# Altium schematic sheet BF24_1.SchDoc
size 300 x 200 mm
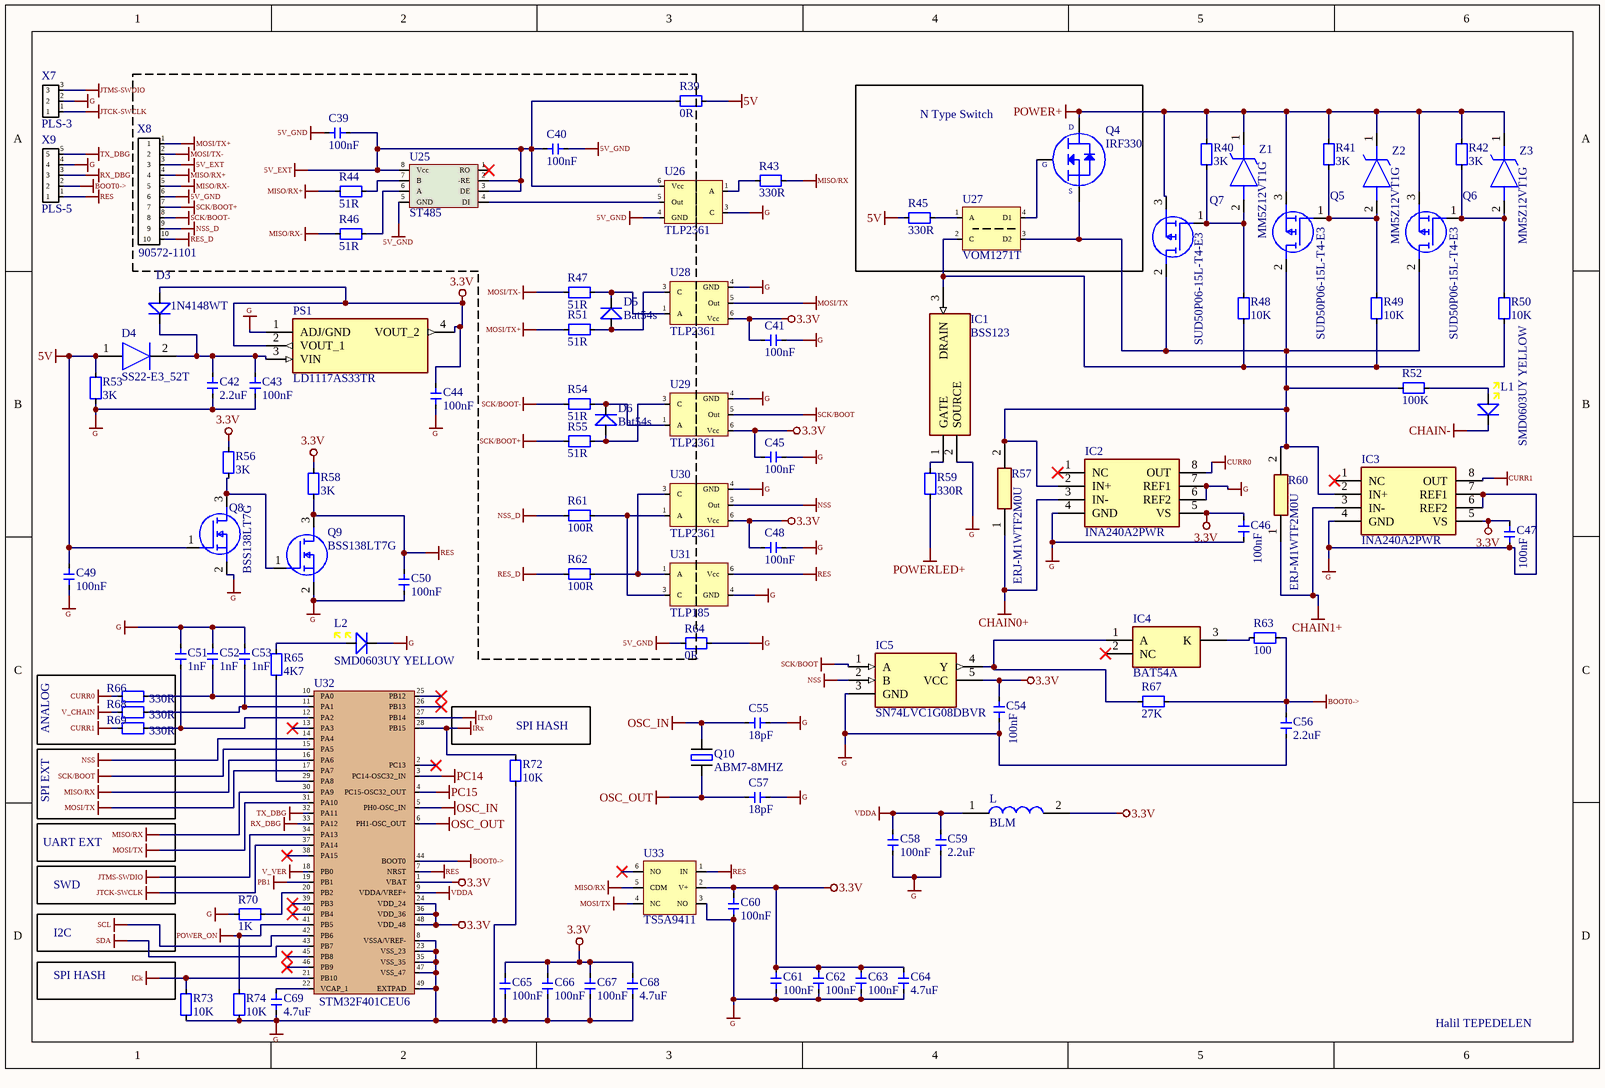
[diagram p0: BF24_1.SchDoc]

## Parts
C39  100nF  [C-0402R]
C40  100nF  [C-0402R]
C41  100nF  [C-0402R]
C42  2.2uF  [C-0402R]
C43  100nF  [C-0402R]
C44  100nF  [C-0402R]
C45  100nF  [C-0402R]
C46  100nF  [C-0402R]
C47  100nF  [C-0402R]
C48  100nF  [C-0402R]
C49  100nF  [C-0402R]
C50  100nF  [C-0402R]
C51  1nF  [C-0603W]
C52  1nF  [C-0603W]
C53  1nF  [C-0603W]
C54  100nF  [C-0402R]
C55  18pF  [C-0402R]
C56  2.2uF  [C-0603W]
C57  18pF  [C-0402R]
C58  100nF  [C-0402R]
C59  2.2uF  [C-0402R]
C60  100nF  [C-0402R]
C61  100nF  [C-0402R]
C62  100nF  [C-0402R]
C63  100nF  [C-0402R]
C64  4.7uF  [C-0603W]
C65  100nF  [C-0402R]
C66  100nF  [C-0402R]
C67  100nF  [C-0402R]
C68  4.7uF  [C-0603W]
C69  4.7uF  [C-0603W]
D3  1N4148WT  [1n4148]
D4  SS22-E3_52T  [ss22]
D5  Bat54s  [bat54s]
D6  Bat54s  [bat54s]
IC1  BSS123  [bss123]
IC2  INA240A2PWR  [ina240]
IC3  INA240A2PWR  [ina240]
IC4  BAT54A  [bat54a]
IC5  SN74LVC1G08DBVR  [sn74lvc]
L  BLM  [R-0603W]
L1  SMD0603UY YELLOW  [R-0603W]
L2  SMD0603UY YELLOW  [R-0603W]
PS1  LD1117AS33TR  [ld1117a]
Q4  IRF330  [DPAK_TO263]
Q5  SUD50P06-15L-T4-E3  [SUD50P0615LT4E3]
Q6  SUD50P06-15L-T4-E3  [SUD50P0615LT4E3]
Q7  SUD50P06-15L-T4-E3  [SUD50P0615LT4E3]
Q8  BSS138LT7G  [bss138]
Q9  BSS138LT7G  [bss138]
Q10  ABM7-8MHZ  [abm-8mhz]
R39  0R  [R-0402R]
R40  3K  [R-0402R]
R41  3K  [R-0402R]
R42  3K  [R-0402R]
R43  330R  [R-0402R]
R44  51R  [R-0603W]
R45  330R  [R-0603W]
R46  51R  [R-0603W]
R47  51R  [R-0603W]
R48  10K  [R-1206W]
R49  10K  [R-1206W]
R50  10K  [R-1206W]
R51  51R  [R-0603W]
R52  100K  [R-0603W]
R53  3K  [R-0402R]
R54  51R  [R-0603W]
R55  51R  [R-0603W]
R56  3K  [R-0402R]
R57  ERJ-M1WTF2M0U  [R-1210R]
R58  3K  [R-0402R]
R59  330R  [R-0603W]
R60  ERJ-M1WTF2M0U  [R-1210R]
R61  100R  [R-0603W]
R62  100R  [R-0603W]
R63  100  [R-0603W]
R64  0R  [R-0402R]
R65  4K7  [R-0603W]
R66  330R  [R-0603W]
R67  27K  [R-0402R]
R68  330R  [R-0603W]
R69  330R  [R-0603W]
R70  1K  [R-0402R]
R72  10K  [R-0402R]
R73  10K  [R-0402R]
R74  10K  [R-0402R]
U25  ST485  [st485]
U26  TLP2361  [tlp2361]
U27  VOM1271T  [vom12]
U28  TLP2361  [tlp2361]
U29  TLP2361  [tlp2361]
U30  TLP2361  [tlp2361]
U31  TLP185  [tlp185]
U32  STM32F401CEU6  [stm32f401ceu6]
U33  TS5A9411  [ts5a9411]
X7  PLS-3  [3pinCon]
X8  90572-1101  [idc20]
X9  PLS-5  [5pinCon]
Z1  MM5Z12VT1G  [mm5z]
Z2  MM5Z12VT1G  [mm5z]
Z3  MM5Z12VT1G  [mm5z]

## Blocks framed on the sheet
N Type Switch: Q4 R45 U27
ANALOG: R66 R68 R69

## Nets
3.3V: C41.1 C44.2 C45.1 C46.2 C47.2 C48.1 C54.2 C60.2 C61.2 C62.2 C63.2 C64.2 C65.2 C66.2 C67.2 C68.2 D3.2 IC2.5(VS) IC3.5(VS) IC5.5(VCC) L.2 PS1.2(VOUT_1) PS1.4(VOUT_2) R56.2 R58.2 U28.6(Vcc) U29.6(Vcc) U30.6(Vcc) U32.1(VBAT) U32.24(VDD_24) U32.36(VDD_36) U32.48(VDD_48) U33.2(V+)
5V: C49.2 D4.1(A) Q8.1(G) R39.2 R45.1 R53.2
5V_EXT: C39.2 C40.1 R39.1 U25.2(-RE) U25.3(DE) U25.8(Vcc) U26.6(Vcc) X8.3
5V_GND: C39.1 C40.2 R64.1 U25.5(GND) U26.4(GND) X8.6
BOOT0->: C56.2 R63.2 R67.2 U32.44(BOOT0) X9.2
CHAIN0+: IC2.3(IN-) R57.1
CHAIN1+: IC3.3(IN-) R60.1
CHAIN-: L1.2
CURR0: IC2.8(OUT) R66.1
CURR1: IC3.8(OUT) R69.1
G: C41.2 C42.1 C43.1 C44.1 C45.2 C46.1 C47.1 C48.2 C49.1 C50.1 C51.2 C52.2 C53.2 C54.1 C55.2 C56.1 C57.2 C58.1 C59.1 C60.1 C61.1 C62.1 C63.1 C64.1 C65.1 C66.1 C67.1 C68.1 C69.1 IC1.2(SOURCE) IC2.4(GND) IC2.6(REF2) IC2.7(REF1) IC3.4(GND) IC3.6(REF2) IC3.7(REF1) IC5.3(GND) L2.2 PS1.1(ADJ/GND) Q8.2(S) Q9.2(S) R53.1 R64.2 R70.1 R72.1 R73.1 R74.1 U26.3(C) U28.4(GND) U29.4(GND) U30.4(GND) U31.4(GND) U32.8(VSSA/VREF-) U32.23(VSS_23) U32.35(VSS_35) U32.47(VSS_47) U32.49(EXTPAD) U33.3(NO) X7.2 X9.4
ICk: R73.2 U32.21(PB10)
IRx: R72.2 U32.28(PB15)
ITx0: U32.27(PB14)
JTCK-SWCLK: U32.37(PA14) X7.1
JTMS-SWDIO: U32.34(PA13) X7.3
MISO/RX: R43.2 U32.16(PA6) U32.30(PA9) U33.5(CDM)
MISO/RX+: R44.1 X8.4
MISO/RX-: R46.1 X8.5
MOSI/TX: U28.5(Out) U32.17(PA7) U32.31(PA10) U33.4(NC)
MOSI/TX+: R51.1 X8.1
MOSI/TX-: R47.1 X8.2
NSS: IC5.2(B) U30.5(Out) U32.14(PA4)
NSS_D: R61.1 X8.9
OSC_IN: C55.1 Q10.1 U32.5(PH0-OSC_IN)
OSC_OUT: C57.1 Q10.2 U32.6(PH1-OSC_OUT)
PB1: U32.19(PB1)
PC14: U32.3(PC14-OSC32_IN)
PC15: U32.4(PC15-OSC32_OUT)
POWER+: Q4.3 Q5.3(S) Q6.3(S) Q7.3(S) R40.2 R41.2 R42.2 Z1.1(K) Z2.1(K) Z3.1(K)
POWER_ON: R74.2 U32.41(PB5)
POWERLED+: R59.1
RES: C50.2 Q9.3(D) R58.1 U31.6(Vcc) U32.7(NRST) U33.1(IN) X9.1
RES_D: R62.1 X8.10
RX_DBG: U32.33(PA12) X9.3
SCK/BOOT: IC5.1(A) U29.5(Out) U32.15(PA5)
SCK/BOOT+: R55.1 X8.7
SCK/BOOT-: R54.1 X8.8
SCL: U32.42(PB6)
SDA: U32.43(PB7)
TX_DBG: U32.32(PA11) X9.5
V_CHAIN: R68.1
V_VER: U32.18(PB0)
VDDA: C58.2 C59.2 L.1 U32.9(VDDA/VREF+)
NetC42_2: C42.2 C43.2 D3.1 D4.2(K) PS1.3(VIN)
NetC51_1: C51.1 R69.2 U32.12(PA2)
NetC52_1: C52.1 R66.2 U32.10(PA0)
NetC53_1: C53.1 R68.2 U32.11(PA1)
NetC69_2: C69.2 U32.22(VCAP_1)
NetD5_1: D5.1 R51.2 U28.3(C)
NetD5_2: D5.2 R47.2 U28.1(A)
NetD6_1: D6.1 R55.2 U29.3(C)
NetD6_2: D6.2 R54.2 U29.1(A)
NetIC1_1: IC1.1(GATE) R59.2
NetIC1_3: IC1.3(DRAIN) R48.1 R49.1 R50.1 U27.2(C)
NetIC2_2: IC2.2(IN+) IC3.2(IN+) Q4.2 Q5.2(D) Q6.2(D) Q7.2(D) R52.1 R57.2 R60.2 U27.3(D2)
NetIC4_1: IC4.1(A) IC5.4(Y) R67.1
NetIC4_3: IC4.3(K) R63.1
NetL1_1: L1.1 R52.2
NetL2_1: L2.1 R65.2
NetQ4_1: Q4.1 U27.4(D1)
NetQ5_1: Q5.1(G) R41.1 R49.2 Z2.2(A)
NetQ6_1: Q6.1(G) R42.1 R50.2 Z3.2(A)
NetQ7_1: Q7.1(G) R40.1 R48.2 Z1.2(A)
NetQ8_3: Q8.3(D) Q9.1(G) R56.1
NetR43_1: R43.1 U26.1(A)
NetR44_2: R44.2 U25.7(B)
NetR45_2: R45.2 U27.1(A)
NetR46_2: R46.2 U25.6(A)
NetR61_2: R61.2 U30.1(A) U31.3(C)
NetR62_2: R62.2 U30.3(C) U31.1(A)
NetR65_1: R65.1 U32.29(PA8)
NetR70_2: R70.2 U32.20(PB2)
NetU25_4: U25.4(DI) U26.5(Out)

Not connected (* = marked no-connect by the designer): IC2 1(NC)*; IC3 1(NC)*; IC4 2(NC)*; U25 1(RO)*; U32 2(PC13)* 13(PA3)* 25(PB12)* 26(PB13)* 38(PA15)* 39(PB3)* 40(PB4)* 45(PB8)* 46(PB9)*; U33 6(NO)*

## Notes on the sheet
- (near R72) SPI HASH
- SPI EXT
- UART EXT
- SWD
- I2C
- SPI HASH
- Halil TEPEDELEN
- (in symbol IRF3330) D; G; S

## Library data of the parts
C39-C41 C43-C50 C54 C58 C60-C63 C65-C67 = 100nF 0402
C42 C59 = 2.2uF 0402
C51-C53 = 1nF 0603
C55 C57 = 18pF 0402
C56 = 2.2uF 0603
C64 C68 C69 = 4.7uF 0603
D4 = SS22-E3_52T: Diode; Manufacturer_Name: Vishay; Manufacturer_Part_Number: SS22-E3/52T; Datasheet Link: https://componentsearchengine.com/Datasheets/2/SS22-E3_52T.pdf; Height: 2.44mm; Arrow Part Number: SS22-E3/52T; Arrow Price/Stock: https://www.arrow.com/en/products/ss22-e352t/vishay; Mouser Part Number: 625-SS22-E3; Mouser Price/Stock: https://www.mouser.com/Search/Refine.aspx?Keyword=625-SS22-E3
IC1 = BSS123: Integrated Circuit; Manufacturer_Name: Nexperia; Datasheet Link: http://docs-emea.rs-online.com/webdocs/1270/0900766b81270fbb.pdf; Height: 1.1mm; Manufacturer_Part_Number: BSS123; Mouser Part Number: N/A; Mouser Price/Stock: https://www.mouser.com/Search/Refine.aspx?Keyword=N%2FA
IC2 IC3 = INA240A2PWR: Integrated Circuit; Manufacturer_Name: Texas Instruments; Datasheet Link: http://www.ti.com/lit/gpn/INA240; Height: 1.2mm; Manufacturer_Part_Number: INA240A2PWR; Arrow Part Number: INA240A2PWR; Arrow Price/Stock: https://www.arrow.com/en/products/ina240a2pwr/texas-instruments; Mouser Part Number: 595-INA240A2PWR; Mouser Price/Stock: https://www.mouser.co.uk/ProductDetail/Texas-Instruments/INA240A2PWR?qs=aVyJF2WnouQyoKZt%2F7Ylhw%3D%3D
IC4 = BAT54A: Integrated Circuit; Manufacturer_Name: STMicroelectronics; Datasheet Link: http://www.st.com/web/en/resource/technical/document/datasheet/CD00001322.pdf; Height: 1.5mm; Manufacturer_Part_Number: BAT54A
IC5 = SN74LVC1G08DBVR: Integrated Circuit; Manufacturer_Name: Texas Instruments; Datasheet Link: http://www.ti.com/lit/ds/symlink/sn74lvc1g08.pdf; Height: 1.45mm; Manufacturer_Part_Number: SN74LVC1G08DBVR; Arrow Part Number: SN74LVC1G08DBVR; Arrow Price/Stock: https://www.arrow.com/en/products/sn74lvc1g08dbvr/texas-instruments; Mouser Part Number: 595-SN74LVC1G08DBVR; Mouser Price/Stock: https://www.mouser.co.uk/ProductDetail/Texas-Instruments/SN74LVC1G08DBVR?qs=8yeEWhuAOtNjtL049wSCoQ%3D%3D
L = blm inductor 0603
PS1 = LD1117AS33TR: Power Supply; Manufacturer_Name: STMicroelectronics; Datasheet Link: https://4donline.ihs.com/images/VipMasterIC/IC/SGST/SGSTS49356/SGSTS49356-1.pdf?hkey=6D3A4C79FDBF58556ACFDE234799DDF0; Height: 1.9mm; Manufacturer_Part_Number: LD1117AS33TR; Arrow Part Number: LD1117AS33TR; Arrow Price/Stock: https://www.arrow.com/en/products/ld1117as33tr/stmicroelectronics; Mouser Part Number: 511-LD1117AS33; Mouser Price/Stock: https://www.mouser.co.uk/ProductDetail/STMicroelectronics/LD1117AS33TR?qs=C3bf%2FVrkE5CoDDd7wyn%252BaQ%3D%3D
Q4 = IRF3330: Manufacturer: Infineon; Manufacturer Part Number: IRF3205STRLPBF; Drain to Source Voltage (Vdss): 55V; Continuous Drain Current (ID): 110A; Rds On Max: 8mR; Input Capacitance: 3.247nF; Max Power Dissipation: 200W; Turn-Off Delay Time: 50ns; Turn-On Delay Time: 14ns; Gate to Source Voltage (Vgs): 20V; Threshold Voltage: 4V; Supplier 1: Digi-Key; RoHS: Yes; Stock 1: 3281; Pricing 1: 1 = 1,84000, 10 = 1,66600, 100 = 1,33840 (USD); Mount: Surface Mount; Case/Package: D2PAK; Number of Pins: 3; Min Operating Temperature: -55°C; Max Operating Temperature: 175°C; Packaging: Cut Tape; Power Dissipation: 200W; Drain to Source Resistance: 8mR; Drain to Source Breakdown Voltage: 55V; Length: 0.42inch; Height: 0.19inch; Width: 0.38inch; REACH SVHC: No SVHC; Lead Free: Lead Free; ComponentLink1URL: https://www.alliedelec.com/m/d/b8827ca43655240244f0cc5c2198e6b1.pdf?src-supplier=Allied+Electronics; ComponentLink1Description: https://www.alliedelec.com/m/d/b8827ca43655240244f0cc5c2198e6b1.pdf?src-supplier=Allied+Electronics; ComponentLink2URL: https://www.infineon.com/dgdl/irf3205spbf.pdf?fileId=5546d462533600a4015355defac9190c&src-supplier=Digi-Key; ComponentLink2Description: https://www.infineon.com/dgdl/irf3205spbf.pdf?fileId=5546d462533600a4015355defac9190c&src-supplier=Digi-Key; ComponentLink3URL: http://www.infineon.com/dgdl/irf3205spbf.pdf?fileId=5546d462533600a4015355defac9190c&src-supplier=Digi-Key; ComponentLink3Description: http://www.infineon.com/dgdl/irf3205spbf.pdf?fileId=5546d462533600a4015355defac9190c&src-supplier=Digi-Key; ComponentLink4URL: http://www.farnell.com/datasheets/1884183.pdf?src-supplier=Element14; ComponentLink4Description: http://www.farnell.com/datasheets/1884183.pdf?src-supplier=Element14; Supplier Part Number 1: IRF3205STRLPBFCT-ND
Q5-Q7 = SUD50P06-15L-T4-E3: MOSFET (P-Channel); Manufacturer_Name: Vishay; Datasheet Link: https://www.mouser.de/datasheet/2/427/sud50p06-15-1764865.pdf; Height: 2.39mm; Manufacturer_Part_Number: SUD50P06-15L-T4-E3; Arrow Part Number: SUD50P06-15L-T4-E3; Arrow Price/Stock: https://www.arrow.com/en/products/sud50p06-15l-t4-e3/vishay; Mouser Part Number: 78-SUD50P06-15L-T4E3; Mouser Price/Stock: https://www.mouser.co.uk/ProductDetail/Vishay-Semiconductors/SUD50P06-15L-T4-E3?qs=G1LhLIAbs1yBu1wo3pIVcA%3D%3D
Q8 Q9 = BSS138LT7G: MOSFET (N-Channel); Manufacturer_Name: ON Semiconductor; Datasheet Link: https://www.mouser.com/datasheet/2/308/BSS138LT1-D-1522521.pdf; Height: 1.11mm; Manufacturer_Part_Number: BSS138LT7G; Arrow Part Number: BSS138LT7G; Arrow Price/Stock: https://www.arrow.com/en/products/bss138lt7g/on-semiconductor; Mouser Part Number: 863-BSS138LT7G; Mouser Price/Stock: https://www.mouser.co.uk/ProductDetail/ON-Semiconductor/BSS138LT7G?qs=l7cgNqFNU1gVGpXKtqpwiw%3D%3D
R39 R64 = 0R 1206
R40-R42 R53 R56 R58 = 3K 0402
R43 = 330R 0402
R44 R46 R47 R51 R54 R55 = 51R 0603_1
R45 R59 R66 R68 R69 = 330R 0603
R48-R50 = 10K 1206
R52 = 100k 0603
R57 R60 = ERJ-M1WTF2M0U: Resistor; Manufacturer_Name: Panasonic; Datasheet Link: https://componentsearchengine.com/Datasheets/1/ERJ-M1WTF2M0U.pdf; Height: 1.1mm; Manufacturer_Part_Number: ERJ-M1WTF2M0U; Arrow Part Number: ERJ-M1WTF2M0U; Arrow Price/Stock: https://www.arrow.com/en/products/erj-m1wtf2m0u/panasonic; Mouser Part Number: 667-ERJ-M1WTF2M0U; Mouser Price/Stock: https://www.mouser.com/Search/Refine.aspx?Keyword=667-ERJ-M1WTF2M0U
R61 R62 = 100R 0603
R63 = 100 0603
R65 = 4K7 0603
R67 = 27K 0402
R70 = 1K 0402
R72-R74 = 10K 0402
Z1-Z3 = MM5Z12VT1G: Zener Diode; Manufacturer_Name: ON Semiconductor; Datasheet Link: http://www.onsemi.com/pub/Collateral/MM5Z2V4T1-D.PDF; Height: 0.7mm; Manufacturer_Part_Number: MM5Z12VT1G; Arrow Part Number: MM5Z12VT1G; Arrow Price/Stock: https://www.arrow.com/en/products/mm5z12vt1g/on-semiconductor; Mouser Part Number: 863-MM5Z12VT1G; Mouser Price/Stock: https://www.mouser.co.uk/ProductDetail/ON-Semiconductor/MM5Z12VT1G?qs=HVbQlW5zcXXd129ZNePICQ%3D%3D